# EAGLE design lvc_v2 (EAGLE 9.2.2)
DOC_NUM: 1; REVISION: A
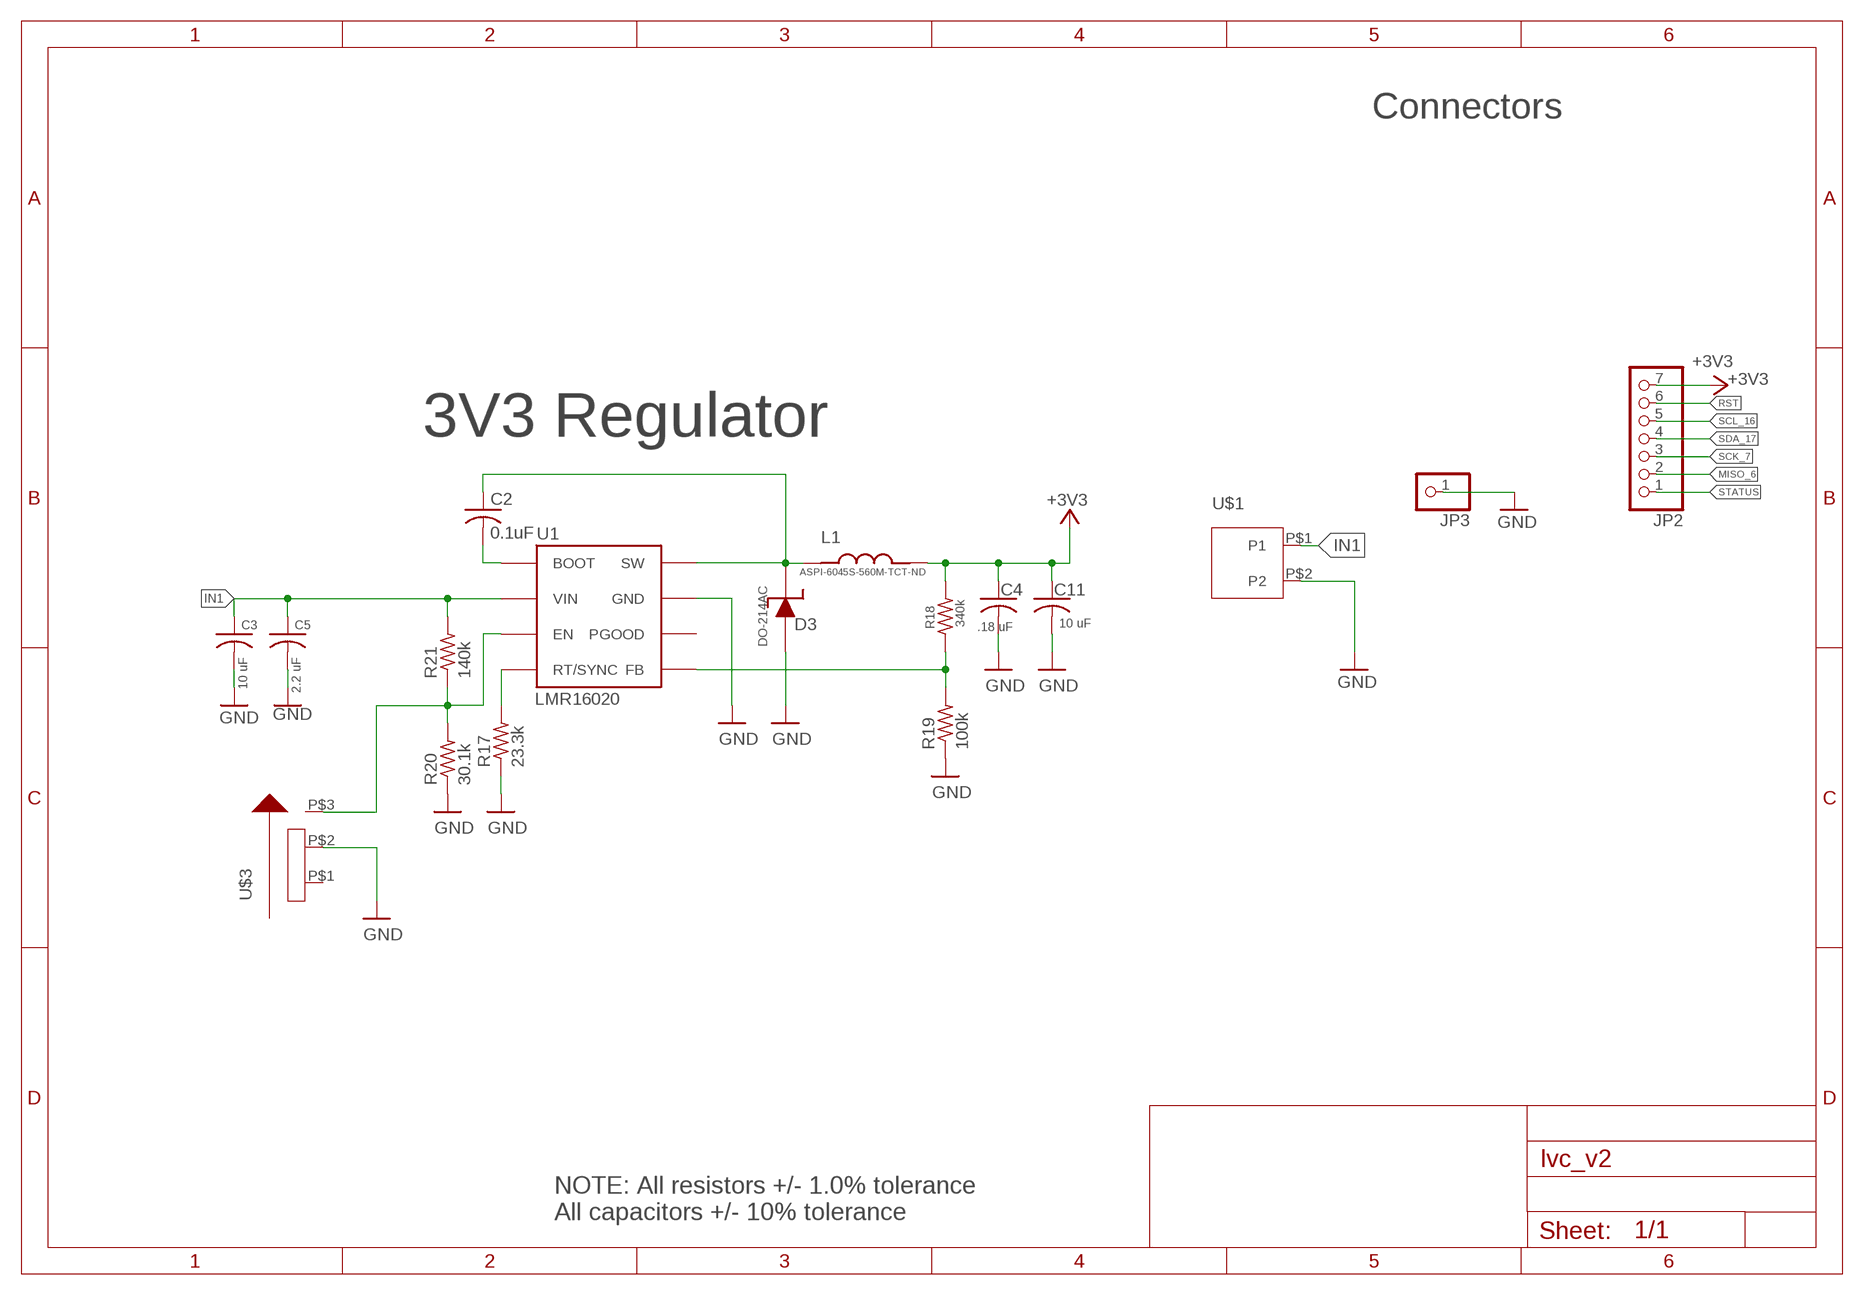
[diagram p0: schematic, sheet 1]

## Parts
C2  0.1uF  C-USC0603  [C0603]
C3  10 uF  C-USC1210  [C1210]
C4  .18 uF  C-USC0603  [C0603]
C5  2.2 uF  C-USC1210  [C1210]
C11  10 uF  C-USC0603  [C0603]
D3  DO-214AC  [DO-214AC]
JP2  PINHD-1X7  [1X07]
JP3  PINHD-1X1  [1X01]
L1  ASPI-6045S-560M-TCT-ND  [ABRACON]
R17  23.3k  R-US_R0603  [R0603]
R18  340k  R-US_R0603  [R0603]
R19  100k  R-US_R0603  [R0603]
R20  30.1k  R-US_R0603  [R0603]
R21  140k  R-US_R0603  [R0603]
U1  LMR16020  [SO8]
U$1  559350210  [559350210]
U$3  CL-SB-12B-01  [CL-SB-12B-01]

## Nets
+3V3: C4.1 C11.1 JP2.7 L1.P$2 R18.2
FB: R18.1 R19.2 U1.P$5(FB)
GND: C3.2 C4.2 C5.2 C11.2 D3.P$1 JP3.1 R17.1 R19.1 R20.1 U1.P$7(GND) U1.PAD(GND) U$1.P$2(P2) U$3.P$2(P2)
IN1: C3.1 C5.1 R21.2 U1.P$2(VIN) U$1.P$1(P1)
MISO_6: JP2.2
N$7: R20.2 R21.1 U1.P$3(EN) U$3.P$3(P3)
N$29: R17.2 U1.P$4(RT/SYNC)
N$31: C2.2 U1.P$1(BOOT)
RST: JP2.6
SCK_7: JP2.3
SCL_16: JP2.5
SDA_17: JP2.4
STATUS: JP2.1
SW: C2.1 D3.P$2 L1.P$1 U1.P$8(SW)
Unconnected: U1.P$6(PGOOD) U$3.P$1(P1)

## Notes on the sheet
- Connectors
- 3V3 Regulator
- NOTE: All resistors +/- 1.0% tolerance
  All capacitors +/- 10% tolerance

## Library data of the parts
C2-C5 C11 = resistor:C-US: CAPACITOR, American symbol
D3 = HASP:DO-214AC
JP2 = pinhead:PINHD-1X7: PIN HEADER
JP3 = pinhead:PINHD-1X1: PIN HEADER
L1 = inductors:ASPI-6045S-560M-TCT-ND
R17-R21 = resistor:R-US_: RESISTOR, American symbol
U1 = HASP:LMR16020
U$1 = jmolterLib:559350210: Molex MicroClasp 2mm Pitch Wire-to-Board Header Right-Angle, 2 Circuits
U$3 = jmolterLib:CL-SB-12B-01: SPDT Slide Switch Manuf: Nidec Copal Electronics

## Board
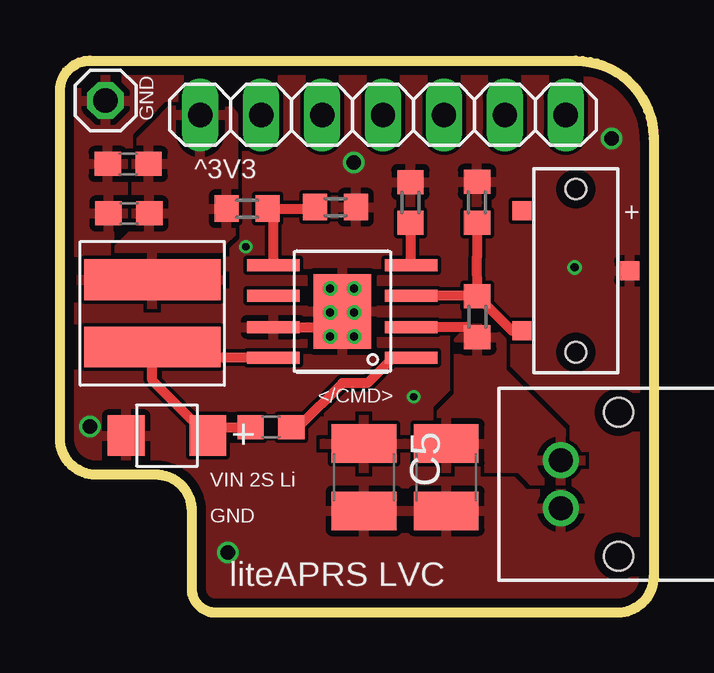
[diagram p1: board, top side]
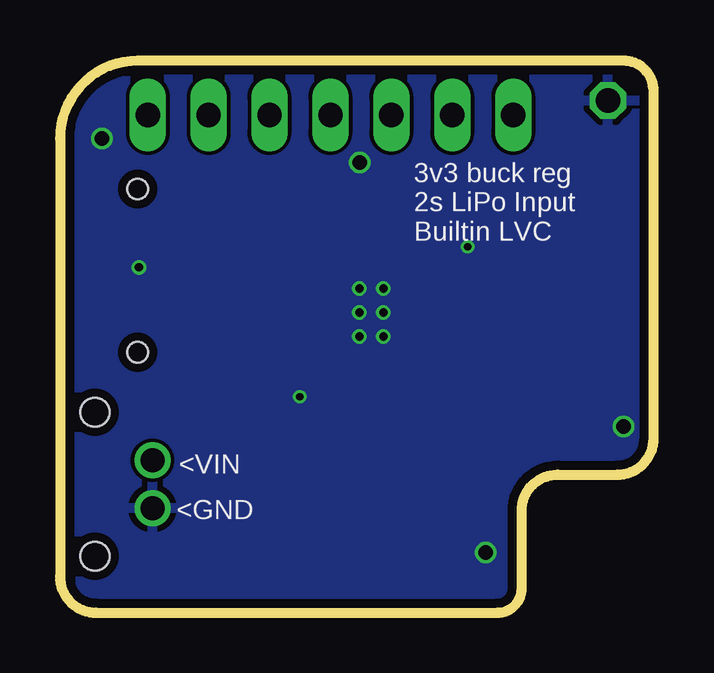
[diagram p2: board, bottom side, seen from below]

Size 24.75 x 23 mm. Coordinates in mm from the lower left corner, seen from the top.
Outline: 1.25,23 21.5,23 arc-90 24.75,19.75 24.75,1.5 arc-90 23.25,0 6.5,0 arc-90 5.5,1 5.5,4.25 arc90 4,5.75 1.5,5.75 arc-90 0,7.25 0,21.75 arc-90 1.25,23
Copper layers (1*16): Top 0.035559375mm / dielectric 1.6mm / Bottom 0.035559375mm
Design rules "oshpark-2layer": minimum track width 6mil, minimum drill 10mil, track to track 6mil, track to pad 6mil, pad to pad 6mil, via to via 6mil, smd to smd 6mil, copper to edge 15mil, drill to drill 6mil, minimum pad ring 5mil, minimum via ring 5mil, stop-mask expansion 2.5mil, vias tented up to drill 0mil, thermal gap 10mil

### Footprints (pad centres in the part's own frame; a part is rotated, then mirrored left to right if it is on the bottom)
C0603 = smd 1.1 x 1: 1 -0.85,0; 2 0.85,0
C1210 = smd 1.6 x 2.7: 1 -1.4,0; 2 1.4,0
DO-214AC = smd 1.524 x 1.676: P$1 -1.702,0; P$2 1.702,0
1X07 = drill 1.016 long: 1 -7.62,0; 2 -5.08,0; 3 -2.54,0; 4 0,0; 5 2.54,0; 6 5.08,0; 7 7.62,0
1X01 = drill 1.016 octagon: 1 0,0
ABRACON = smd 1.7 x 5.7: P$1 1.4,0; P$2 -1.4,0
R0603 = smd 1 x 1.1: 1 -0.85,0; 2 0.85,0
SO8 = smd 0.5 x 2.2: P$1 -1.92,-2.875; P$2 -0.65,-2.875; P$3 0.65,-2.875; P$4 1.92,-2.875; P$5 1.92,2.875; P$6 0.65,2.875; P$7 -0.65,2.875; P$8 -1.92,2.875 | smd 3.1 x 2.4: PAD 0,0
559350210 = drill 1: P$1 3,-9.2; P$2 5,-9.2 | hole 1.2: 1,-6.8; 7,-6.8
CL-SB-12B-01 = smd 0.8 x 0.8: P$1 1.75,-4; P$2 4.25,0.5; P$3 6.75,-4 | hole 0.85: 0.85,-1.75; 7.65,-1.75

### Placement (x,y rotation side)
C2  8.8,7.72 0 top
C3  16.11,5.64 270 top
C4  2.88,16.64 180 top
C5  12.68,5.64 270 top
C11  2.85,18.7 180 top
D3  4.46,7.38 0 top
JP2  13.47,20.74 180 top
JP3  1.9,21.34 0 top
L1  3.85,12.47 270 top
R17  14.61,17.09 270 top
R18  7.8,16.84 180 top
R19  11.49,16.89 180 top
R20  17.39,17.1 270 top
R21  17.4,12.33 270 top
U1  11.77,12.55 90 top
U$1  30.09,9.35 270 top
U$3  23.26,18.5 270 top

### Tracks (layer width: path | path; a pad name or v marks a point on that pad's centre or on a via)
+3V3
  pour Top: 0.88,14.9 0.88,12.87 6.72,12.87 6.72,15.41 7.23,15.92 7.23,20.74 6.22,21.76 5.45,21.76 3.17,19.47 3.17,15.92 2.15,14.9
FB
  Top 0.406: R19.2 10.58,16.84 R18.1 8.9,16.59 U1.P$5
GND  (via drill 0.3, 0.35, 0.6)
  Top 0.406: U1.P$7 11.12,11.9 U1.PAD
  other vias: 11.26,12.5 11.26,11.5 12.26,11.5 12.26,12.5 12.26,13.5 11.26,13.5 21.46,14.39 7,2.5 1.25,7.75 23,19.75 14.75,9 12.25,18.75 7.75,15.25
  pour Top (rank 6): -8.77,23.79 25.52,23.79 25.52,-3.77 -8.77,-3.77
  pour Bottom: -10.04,25.06 26.79,25.06 26.79,-2.79 -10.04,-2.79
IN1
  Top 0.406: R21.2 16.98,11.9 U1.P$2
  pour Top: 21.7,5.49 19.69,5.49 19.17,6.01 11.3,6.01 11.04,6.26 11.04,7.79 11.3,8.04 15.61,8.04 16.63,9.06 16.63,11.34 17.14,11.85 17.9,11.85 18.41,11.34 18.41,10.06 21.7,6.77
N$7
  Top 0.406: R20.2 17.39,14.84 R21.1 | R21.1 17.18,13.2 U1.P$3 | R21.1 18.84,11.75 U$3.P$3
N$29
  Top 0.406: R17.2 14.61,14.5 U1.P$4
N$31
  Top 0.406: U1.P$1 13.88,10.63 12.82,9.57 11.78,9.57 9.93,7.72 C2.2
SW
  Top 0.406: U1.P$8 4.29,10.63 L1.P$1 3.85,9.69 D3.P$2 arc90 6.51,7.72 C2.1

### Text on the board
tPlace: GND | ^3V3 | + | </CMD> | VIN 2S Li | GND | liteAPRS LVC
bPlace: 3v3 buck reg / 2s LiPo Input / Builtin LVC | <VIN | <GND
Document: 2oz Copper / FR-4 or 408 / 1.0±0.1 Via plate thickness